# EAGLE design IR_and_skip (EAGLE 5.11)
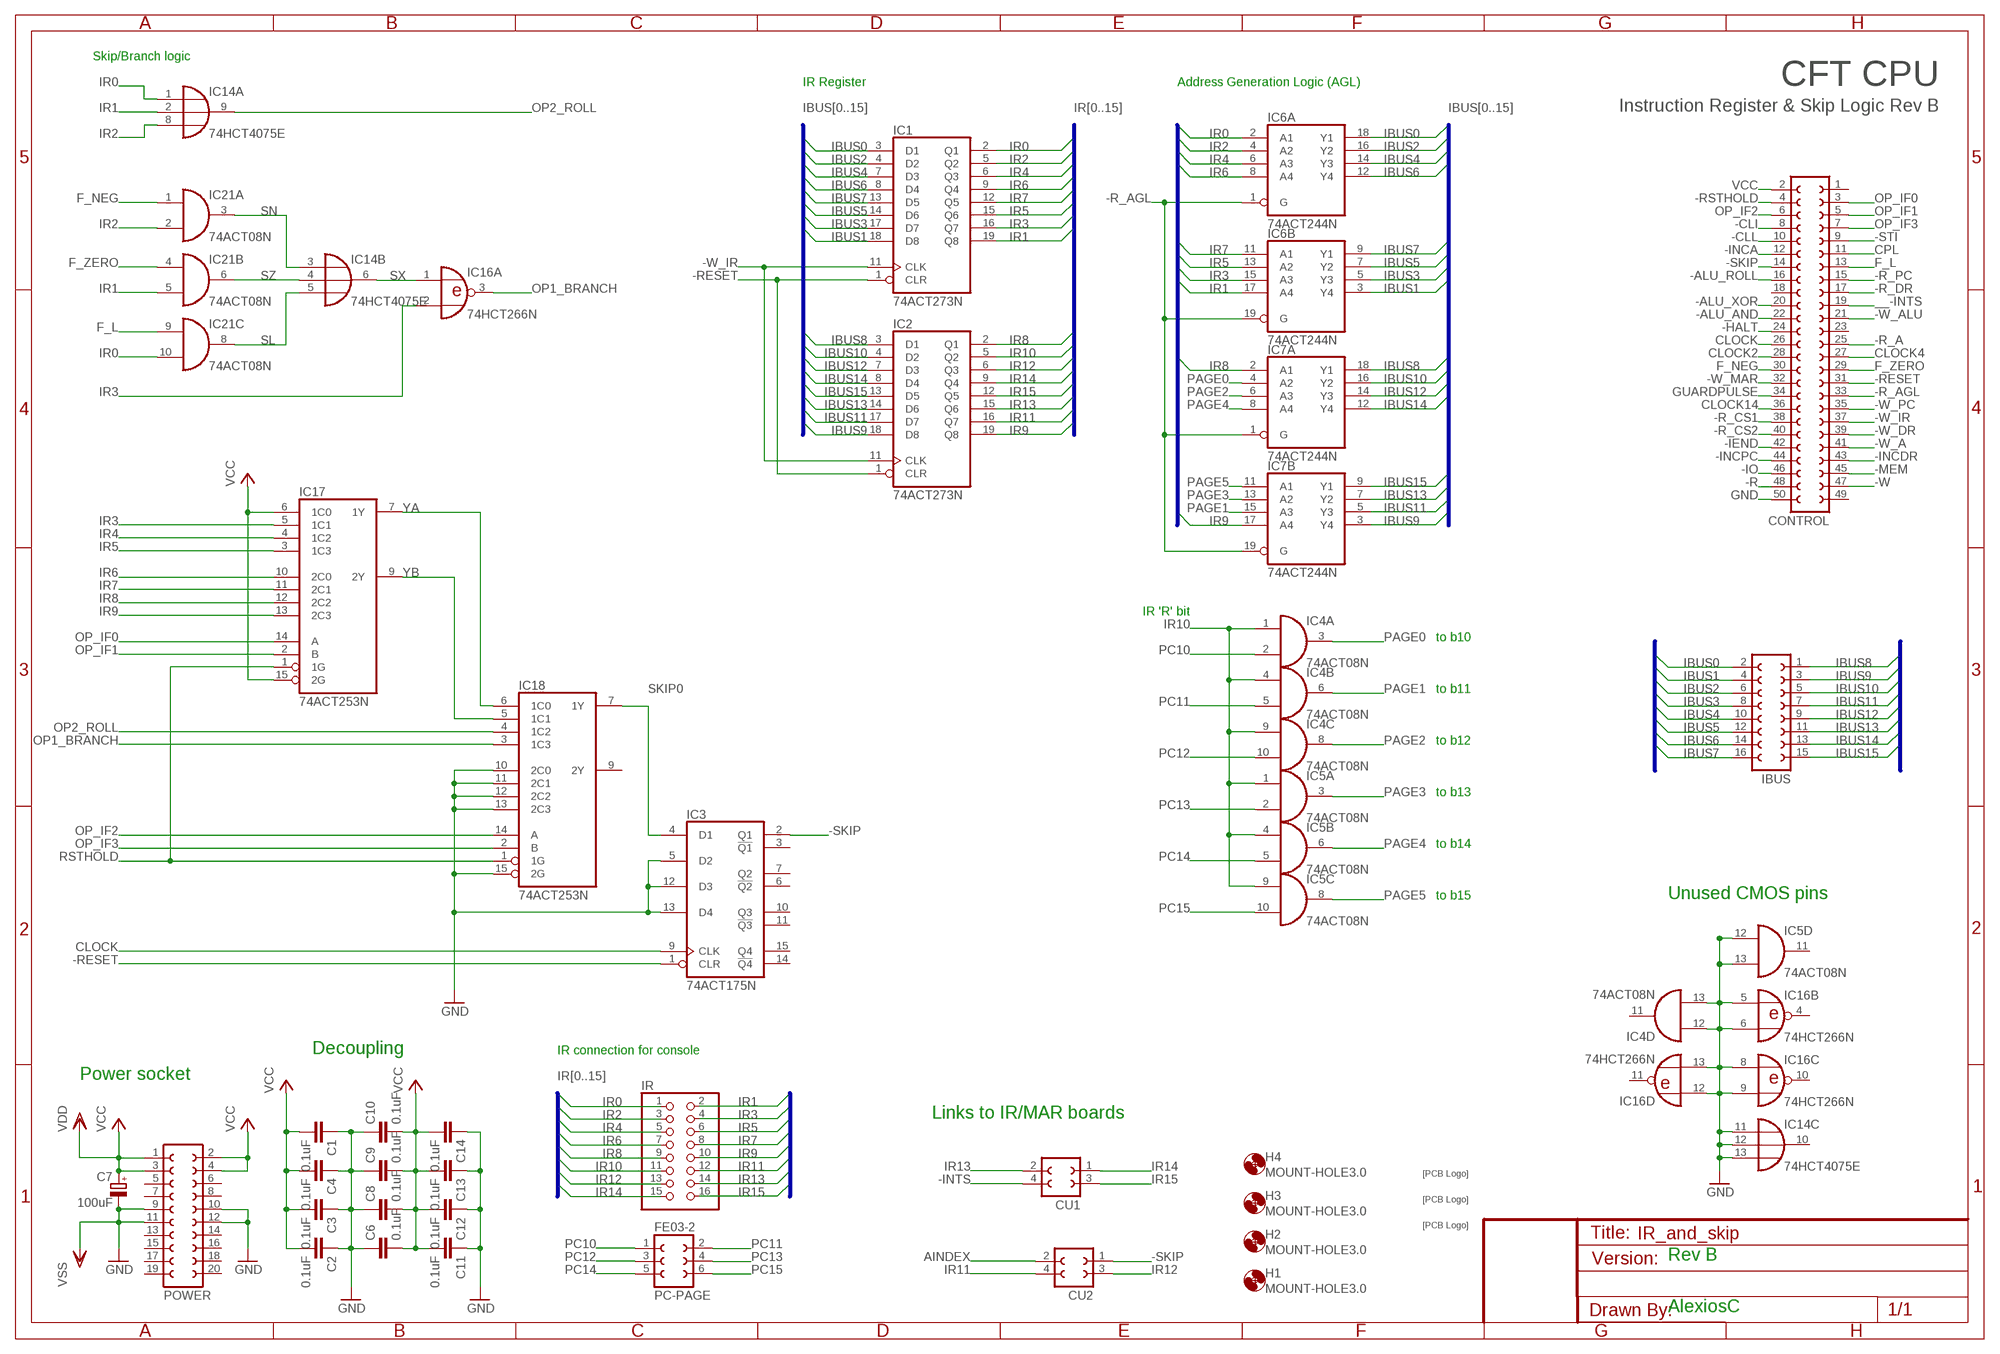
[diagram p0: schematic, sheet 1]

## Parts
C1  0.1uF  C-EU025-025X050  [C025-025X050]
C2  0.1uF  C-EU025-025X050  [C025-025X050]
C3  0.1uF  C-EU025-025X050  [C025-025X050]
C4  0.1uF  C-EU025-025X050  [C025-025X050]
C6  0.1uF  C-EU025-025X050  [C025-025X050]
C7  100uF  CPOL-EUE2.5-6  [E2,5-6]
C8  0.1uF  C-EU025-025X050  [C025-025X050]
C9  0.1uF  C-EU025-025X050  [C025-025X050]
C10  0.1uF  C-EU025-025X050  [C025-025X050]
C11  0.1uF  C-EU025-025X050  [C025-025X050]
C12  0.1uF  C-EU025-025X050  [C025-025X050]
C13  0.1uF  C-EU025-025X050  [C025-025X050]
C14  0.1uF  C-EU025-025X050  [C025-025X050]
CONTROL  FE25-2  [FE25-2]
CU1  FE02-2  [FE02-2]
CU2  FE02-2  [FE02-2]
H1  MOUNT-HOLE3.0  [3,0]
H2  MOUNT-HOLE3.0  [3,0]
H3  MOUNT-HOLE3.0  [3,0]
H4  MOUNT-HOLE3.0  [3,0]
IBUS  FE08-2  [FE08-2]
IC1  74ACT273N  [DIL20]
IC2  74ACT273N  [DIL20]
IC3  74ACT175N  [DIL16]
IC4  74ACT08N  [DIL14]
IC5  74ACT08N  [DIL14]
IC6  74ACT244N  [DIL20]
IC7  74ACT244N  [DIL20]
IC14  74HCT4075E  4075N  [DIL14]
IC16  74HCT266N  74HC266N  [DIL14]
IC17  74ACT253N  [DIL16]
IC18  74ACT253N  [DIL16]
IC21  74ACT08N  [DIL14]
IR  PINHD-2X8/90  [2X08/90]
PC-PAGE  FE03-2  [FE03-2]
POWER  FE10-2  [FE10-2]
U$1  SIGNATUREPLANE  [SIGNATURE_PLANE]
U$2  SIGNATUREPLANE  [SIGNATURE_PLANE]
U$3  SIGNATURESILK  [SIGNATURE]

## Nets
-ALU_AND: CONTROL.22
-ALU_ROLL: CONTROL.16
-ALU_XOR: CONTROL.20
-CLI: CONTROL.8
-CLL: CONTROL.10
-HALT: CONTROL.24
-IEND: CONTROL.42
-INCA: CONTROL.12
-INCDR: CONTROL.43
-INCPC: CONTROL.44
-INTS: CU1.4
-IO: CONTROL.46
-MEM: CONTROL.45
-R: CONTROL.48
-R_A: CONTROL.25
-R_AGL: CONTROL.33 IC6.1(A:G) IC6.19(B:G) IC7.1(A:G) IC7.19(B:G)
-R_CS1: CONTROL.38
-R_CS2: CONTROL.40
-R_DR: CONTROL.17
-R_PC: CONTROL.15
-RESET: CONTROL.31 IC1.1(CLR) IC2.1(CLR) IC3.1(CLR)
-RSTHOLD: CONTROL.4
-SKIP: CONTROL.14 CU2.1 IC3.2(Q1)
-STI: CONTROL.9
-W: CONTROL.47
-W_A: CONTROL.41
-W_ALU: CONTROL.21
-W_DR: CONTROL.39
-W_IR: CONTROL.37 IC1.11(CLK) IC2.11(CLK)
-W_MAR: CONTROL.32
-W_PC: CONTROL.35
AINDEX: CU2.2
CLOCK: CONTROL.26 IC3.9(CLK)
CLOCK2: CONTROL.28
CLOCK4: CONTROL.27
CLOCK14: CONTROL.36
CPL: CONTROL.11
F_L: CONTROL.13 IC21.9(C:I0)
F_NEG: CONTROL.30 IC21.1(A:I0)
F_ZERO: CONTROL.29 IC21.4(B:I0)
GND: C1.1 C2.1 C3.1 C4.1 C6.1 C7.- C8.1 C9.1 C10.1 C11.1 C12.1 C13.1 C14.1 CONTROL.50 IC3.5(D2) IC3.12(D3) IC3.13(D4) IC4.12(D:I0) IC4.13(D:I1) IC5.12(D:I0) IC5.13(D:I1) IC14.11(C:I0) IC14.12(C:I1) IC14.13(C:I2) IC16.5(B:I0) IC16.6(B:I1) IC16.8(C:I0) IC16.9(C:I1) IC16.12(D:I0) IC16.13(D:I1) IC18.10(2C0) IC18.11(2C1) IC18.12(2C2) IC18.13(2C3) IC18.15(2G) POWER.9 POWER.10 POWER.11 POWER.12 ; supply symbol labelled VSS
GUARDPULSE: CONTROL.34
IBUS0: IBUS.2 IC1.3(D1) IC6.18(A:Y1)
IBUS1: IBUS.4 IC1.18(D8) IC6.3(B:Y4)
IBUS2: IBUS.6 IC1.4(D2) IC6.16(A:Y2)
IBUS3: IBUS.8 IC1.17(D7) IC6.5(B:Y3)
IBUS4: IBUS.10 IC1.7(D3) IC6.14(A:Y3)
IBUS5: IBUS.12 IC1.14(D6) IC6.7(B:Y2)
IBUS6: IBUS.14 IC1.8(D4) IC6.12(A:Y4)
IBUS7: IBUS.16 IC1.13(D5) IC6.9(B:Y1)
IBUS8: IBUS.1 IC2.3(D1) IC7.18(A:Y1)
IBUS9: IBUS.3 IC2.18(D8) IC7.3(B:Y4)
IBUS10: IBUS.5 IC2.4(D2) IC7.16(A:Y2)
IBUS11: IBUS.7 IC2.17(D7) IC7.5(B:Y3)
IBUS12: IBUS.9 IC2.7(D3) IC7.14(A:Y3)
IBUS13: IBUS.11 IC2.14(D6) IC7.7(B:Y2)
IBUS14: IBUS.13 IC2.8(D4) IC7.12(A:Y4)
IBUS15: IBUS.15 IC2.13(D5) IC7.9(B:Y1)
IR0: IC1.2(Q1) IC6.2(A:A1) IC14.1(A:I0) IC21.10(C:I1) IR.1
IR1: IC1.19(Q8) IC6.17(B:A4) IC14.2(A:I1) IC21.5(B:I1) IR.2
IR2: IC1.5(Q2) IC6.4(A:A2) IC14.8(A:I2) IC21.2(A:I1) IR.3
IR3: IC1.16(Q7) IC6.15(B:A3) IC16.2(A:I1) IC17.5(1C1) IR.4
IR4: IC1.6(Q3) IC6.6(A:A3) IC17.4(1C2) IR.5
IR5: IC1.15(Q6) IC6.13(B:A2) IC17.3(1C3) IR.6
IR6: IC1.9(Q4) IC6.8(A:A4) IC17.10(2C0) IR.7
IR7: IC1.12(Q5) IC6.11(B:A1) IC17.11(2C1) IR.8
IR8: IC2.2(Q1) IC7.2(A:A1) IC17.12(2C2) IR.9
IR9: IC2.19(Q8) IC7.17(B:A4) IC17.13(2C3) IR.10
IR10: IC2.5(Q2) IC4.1(A:I0) IC4.4(B:I0) IC4.9(C:I0) IC5.1(A:I0) IC5.4(B:I0) IC5.9(C:I0) IR.11
IR11: CU2.4 IC2.16(Q7) IR.12
IR12: CU2.3 IC2.6(Q3) IR.13
IR13: CU1.2 IC2.15(Q6) IR.14
IR14: CU1.1 IC2.9(Q4) IR.15
IR15: CU1.3 IC2.12(Q5) IR.16
OP1_BRANCH: IC16.3(A:O) IC18.3(1C3)
OP2_ROLL: IC14.9(A:O) IC18.4(1C2)
OP_IF0: CONTROL.3 IC17.14(A)
OP_IF1: CONTROL.5 IC17.2(B)
OP_IF2: CONTROL.6 IC18.14(A)
OP_IF3: CONTROL.7 IC18.2(B)
PAGE0: IC4.3(A:O) IC7.4(A:A2)
PAGE1: IC4.6(B:O) IC7.15(B:A3)
PAGE2: IC4.8(C:O) IC7.6(A:A3)
PAGE3: IC5.3(A:O) IC7.13(B:A2)
PAGE4: IC5.6(B:O) IC7.8(A:A4)
PAGE5: IC5.8(C:O) IC7.11(B:A1)
PC10: IC4.2(A:I1) PC-PAGE.1
PC11: IC4.5(B:I1) PC-PAGE.2
PC12: IC4.10(C:I1) PC-PAGE.3
PC13: IC5.2(A:I1) PC-PAGE.4
PC14: IC5.5(B:I1) PC-PAGE.5
PC15: IC5.10(C:I1) PC-PAGE.6
RSTHOLD: IC17.1(1G) IC18.1(1G)
SKIP0: IC3.4(D1) IC18.7(1Y)
SL: IC14.5(B:I2) IC21.8(C:O)
SN: IC14.3(B:I0) IC21.3(A:O)
SX: IC14.6(B:O) IC16.1(A:I0)
SZ: IC14.4(B:I1) IC21.6(B:O)
VCC: C1.2 C2.2 C3.2 C4.2 C6.2 C7.+ C8.2 C9.2 C10.2 C11.2 C12.2 C13.2 C14.2 CONTROL.2 IC17.6(1C0) IC17.15(2G) POWER.1 POWER.2 POWER.3 POWER.4 ; supply symbol labelled VDD
YA: IC17.7(1Y) IC18.6(1C0)
YB: IC17.9(2Y) IC18.5(1C1)
Unconnected: CONTROL.1 CONTROL.18 CONTROL.19 CONTROL.23 CONTROL.49 IC3.3(!Q1) IC3.6(!Q2) IC3.7(Q2) IC3.10(Q3) IC3.11(!Q3) IC3.14(!Q4) IC3.15(Q4) IC4.11(D:O) IC5.11(D:O) IC14.10(C:O) IC16.4(B:O) IC16.10(C:O) IC16.11(D:O) IC18.9(2Y) IC21.11(D:O) IC21.12(D:I0) IC21.13(D:I1) POWER.5 POWER.6 POWER.7 POWER.8 POWER.13 POWER.14 POWER.15 POWER.16 POWER.17 POWER.18 POWER.19 POWER.20

## Buses
IBUS[0..15]
IR[0..15]

## Notes on the sheet
- Skip/Branch logic
- IR Register | Address Generation Logic (AGL) | CFT CPU
- Instruction Register & Skip Logic Rev B
- IR 'R' bit
- to b10
- to b11
- to b12
- to b13
- to b14
- to b15 | Unused CMOS pins
- Decoupling | IR connection for console
- Power socket
- Links to IR/MAR boards
- Rev B
- AlexiosC

## Power pins joined to a net without a drawn wire
GND: IC1.10(GND) IC2.10(GND) IC3.8(GND) IC4.7(P:GND) IC5.7(P:GND) IC6.10(P:GND) IC7.10(P:GND) IC14.7(P:VSS) IC16.7(P:GND) IC17.8(GND) IC18.8(GND) IC21.7(P:GND)
VCC: IC1.20(VCC) IC2.20(VCC) IC3.16(VCC) IC4.14(P:VCC) IC5.14(P:VCC) IC6.20(P:VCC) IC7.20(P:VCC) IC14.14(P:VDD) IC16.14(P:VCC) IC17.16(VCC) IC18.16(VCC) IC21.14(P:VCC)

## Library data of the parts
C1-C4 C6 C8-C14 = rcl:C-EU: CAPACITOR, European symbol
C7 = rcl:CPOL-EU: POLARIZED CAPACITOR, European symbol
CONTROL = con-lsta:FE25-2: FEMALE HEADER
CU1 CU2 = alexios:FE02-2: A 2x2 pin female header.
H1-H4 = holes:MOUNT-HOLE: MOUNTING HOLE with drill center marker
IBUS = con-lsta:FE08-2: FEMALE HEADER
IC1 IC2 = 74xx-eu:74*273: Octal D type FLIP FLOP, clear
IC3 = 74xx-eu:74*175: Qadruple D type FLIP FLOP, clear
IC4 IC5 IC21 = 74xx-eu:74*08: Quad 2-input AND gate
IC6 IC7 = 74xx-eu:74*244: Octal BUFFER and LINE DRIVER, 3-state
IC14 = 40xx:4075: Triple 3-input OR
IC16 = 74xx-eu:74*266: Quadruple EXCLUSIVE-NOR (XNOR), open-collector
IC17 IC18 = 74xx-eu:74*253: Dual 4-to 1 line data SELECTOR/MULTIPLEXER, 3-state
IR = pinhead:PINHD-2X8: PIN HEADER
PC-PAGE = alexios:FE03-2: A 2x3 female header.
POWER = con-lsta:FE10-2: FEMALE HEADER; OC_FARNELL: unknown; OC_NEWARK: unknown
U$1-U$3 = alexios:SIGNATURE: Soup signature

## Net classes
0 default: width 0.406 mm, clearance 0.305 mm
1 Decoupling: width 1.27 mm

## Board
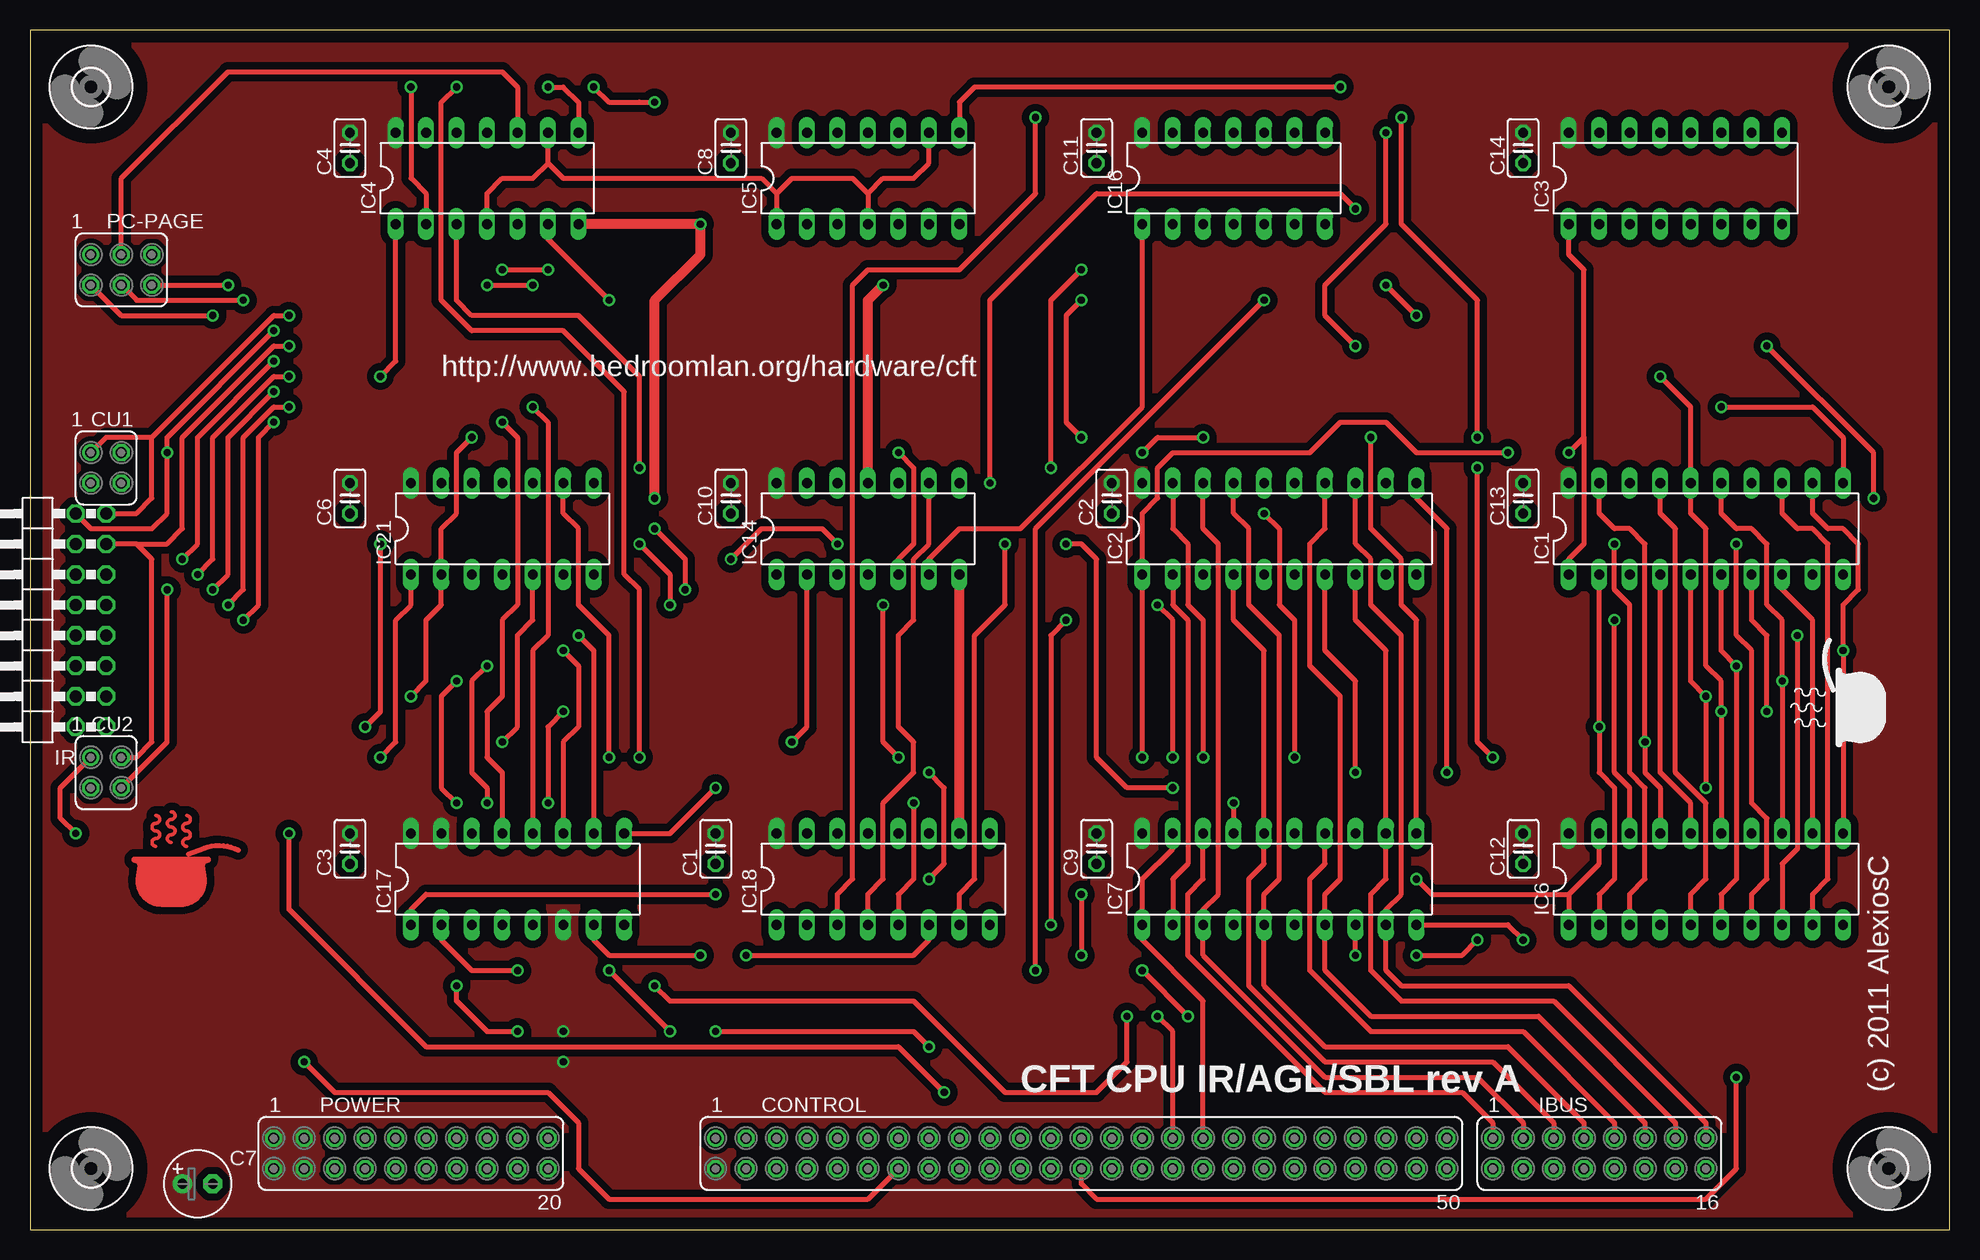
[diagram p1: board, top side]
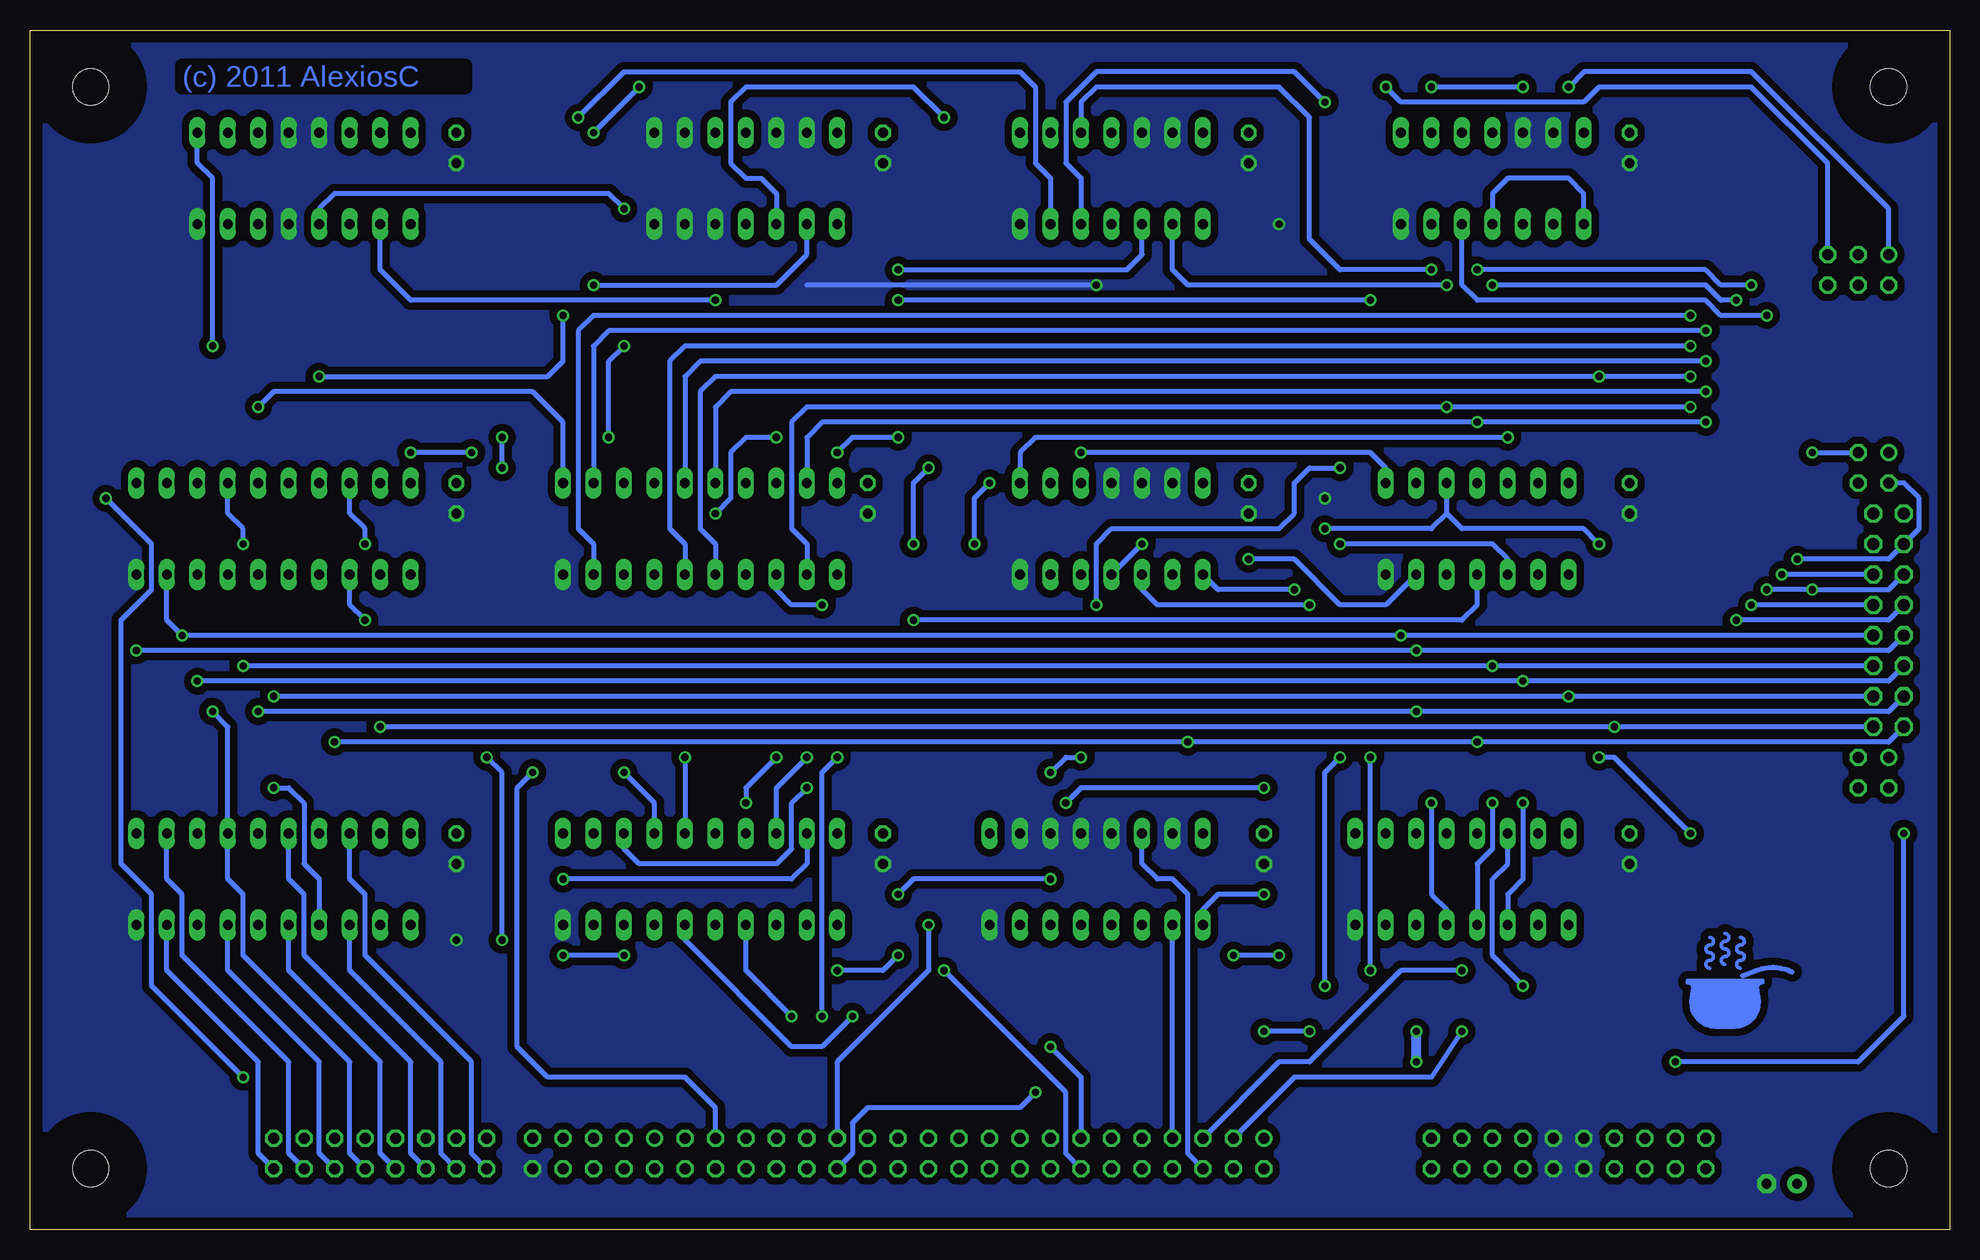
[diagram p2: board, bottom side, seen from below]

Size 160 x 100 mm. Coordinates in mm from the lower left corner, seen from the top.
Outline: 0,0 160,0 160,100 0,100 0,0
Copper layers (1*16): Top 0.035mm / dielectric 1.5mm / Bottom 0.035mm
Design rules "olimex-10mil": minimum track width 10mil, minimum drill 24mil, track to track 10mil, track to pad 10mil, pad to pad 10mil, via to via 10mil, smd to smd 10mil, copper to edge 40mil, drill to drill 10mil, minimum pad ring 10mil, minimum via ring 8mil, stop-mask expansion 0mil, vias tented up to drill 0mil, thermal gap 10mil

### Footprints (pad centres in the part's own frame; a part is rotated, then mirrored left to right if it is on the bottom)
C025-025X050 = drill 0.813 octagon: 1 -1.27,0; 2 1.27,0
E2,5-6 = drill 0.813 pad 1.6 round: + -1.27,0 | drill 0.813 pad 1.6 octagon: - 1.27,0
FE25-2 = drill 0.914 round: 1 -30.48,1.27; 41 20.32,1.27 | drill 0.914 octagon: 2 -30.48,-1.27; 3 -27.94,1.27; 4 -27.94,-1.27; 5 -25.4,1.27; 6 -25.4,-1.27; 7 -22.86,1.27; 8 -22.86,-1.27; 9 -20.32,1.27; 10 -20.32,-1.27; 11 -17.78,1.27; 12 -17.78,-1.27; 13 -15.24,1.27; 14 -15.24,-1.27; 15 -12.7,1.27; 16 -12.7,-1.27; 17 -10.16,1.27; 18 -10.16,-1.27; 19 -7.62,1.27; 20 -7.62,-1.27; 21 -5.08,1.27; 22 -5.08,-1.27; 23 -2.54,1.27; 24 -2.54,-1.27; 25 0,1.27; 26 0,-1.27; 27 2.54,1.27; 28 2.54,-1.27; 29 5.08,1.27; 30 5.08,-1.27; 31 7.62,1.27; 32 7.62,-1.27; 33 10.16,1.27; 34 10.16,-1.27; 35 12.7,1.27; 36 12.7,-1.27; 37 15.24,1.27; 38 15.24,-1.27; 39 17.78,1.27; 40 17.78,-1.27; 42 20.32,-1.27; 43 22.86,1.27; 44 22.86,-1.27; 45 25.4,1.27; 46 25.4,-1.27; 47 27.94,1.27; 48 27.94,-1.27; 49 30.48,1.27; 50 30.48,-1.27
FE02-2 = drill 0.914 round: 1 -1.27,1.27 | drill 0.914 octagon: 2 -1.27,-1.27; 3 1.27,1.27; 4 1.27,-1.27
3,0 = hole 3: 0,0
FE08-2 = drill 0.914 octagon: 1 -8.89,1.27; 2 -8.89,-1.27; 3 -6.35,1.27; 4 -6.35,-1.27; 5 -3.81,1.27; 6 -3.81,-1.27; 7 -1.27,1.27; 8 -1.27,-1.27; 9 1.27,1.27; 10 1.27,-1.27; 11 3.81,1.27; 12 3.81,-1.27; 13 6.35,1.27; 14 6.35,-1.27; 15 8.89,1.27; 16 8.89,-1.27
DIL20 = drill 0.813 long: 1 -11.43,-3.81; 2 -8.89,-3.81; 3 -6.35,-3.81; 4 -3.81,-3.81; 5 -1.27,-3.81; 6 1.27,-3.81; 7 3.81,-3.81; 8 6.35,-3.81; 9 8.89,-3.81; 10 11.43,-3.81; 11 11.43,3.81; 12 8.89,3.81; 13 6.35,3.81; 14 3.81,3.81; 15 1.27,3.81; 16 -1.27,3.81; 17 -3.81,3.81; 18 -6.35,3.81; 19 -8.89,3.81; 20 -11.43,3.81
DIL16 = drill 0.813 long: 1 -8.89,-3.81; 2 -6.35,-3.81; 3 -3.81,-3.81; 4 -1.27,-3.81; 5 1.27,-3.81; 6 3.81,-3.81; 7 6.35,-3.81; 8 8.89,-3.81; 9 8.89,3.81; 10 6.35,3.81; 11 3.81,3.81; 12 1.27,3.81; 13 -1.27,3.81; 14 -3.81,3.81; 15 -6.35,3.81; 16 -8.89,3.81
DIL14 = drill 0.813 long: 1 -7.62,-3.81; 2 -5.08,-3.81; 3 -2.54,-3.81; 4 0,-3.81; 5 2.54,-3.81; 6 5.08,-3.81; 7 7.62,-3.81; 8 7.62,3.81; 9 5.08,3.81; 10 2.54,3.81; 11 0,3.81; 12 -2.54,3.81; 13 -5.08,3.81; 14 -7.62,3.81
2X08/90 = drill 1.016 octagon: 1 -8.89,-6.35; 2 -8.89,-3.81; 3 -6.35,-6.35; 4 -6.35,-3.81; 5 -3.81,-6.35; 6 -3.81,-3.81; 7 -1.27,-6.35; 8 -1.27,-3.81; 9 1.27,-6.35; 10 1.27,-3.81; 11 3.81,-6.35; 12 3.81,-3.81; 13 6.35,-6.35; 14 6.35,-3.81; 15 8.89,-6.35; 16 8.89,-3.81
FE03-2 = drill 0.914 round: 1 -2.54,1.27 | drill 0.914 octagon: 2 -2.54,-1.27; 3 0,1.27; 4 0,-1.27; 5 2.54,1.27; 6 2.54,-1.27
FE10-2 = drill 0.914 octagon: 1 -11.43,1.27; 2 -11.43,-1.27; 3 -8.89,1.27; 4 -8.89,-1.27; 5 -6.35,1.27; 6 -6.35,-1.27; 7 -3.81,1.27; 8 -3.81,-1.27; 9 -1.27,1.27; 10 -1.27,-1.27; 11 1.27,1.27; 12 1.27,-1.27; 13 3.81,1.27; 14 3.81,-1.27; 15 6.35,1.27; 16 6.35,-1.27; 17 8.89,1.27; 18 8.89,-1.27; 19 11.43,1.27; 20 11.43,-1.27

### Placement (x,y rotation side)
C1  57.15,31.75 90 top
C2  90.17,60.96 90 top
C3  26.67,31.75 90 top
C4  26.67,90.17 90 top
C6  26.67,60.96 90 top
C7  13.97,3.81 0 top
C8  58.42,90.17 90 top
C9  88.9,31.75 90 top
C10  58.42,60.96 90 top
C11  88.9,90.17 90 top
C12  124.46,31.75 90 top
C13  124.46,60.96 90 top
C14  124.46,90.17 90 top
CONTROL  87.63,6.35 0 top
CU1  6.35,63.5 0 top
CU2  6.35,38.1 0 top
H1  154.94,95.25 0 top
H2  154.94,5.08 0 top
H3  5.08,5.08 0 top
H4  5.08,95.25 0 top
IBUS  130.81,6.35 0 top
IC1  139.7,58.42 0 top
IC2  104.14,58.42 0 top
IC3  137.16,87.63 0 top
IC4  38.1,87.63 0 top
IC5  69.85,87.63 0 top
IC6  139.7,29.21 0 top
IC7  104.14,29.21 0 top
IC14  69.85,58.42 0 top
IC16  100.33,87.63 0 top
IC17  40.64,29.21 0 top
IC18  71.12,29.21 0 top
IC21  39.37,58.42 0 top
IR  0,50.8 90 top
PC-PAGE  7.62,80.01 0 top
POWER  31.75,6.35 0 top
U$1  8.89,26.67 0 top
U$2  21.59,16.51 0 bottom
U$3  154.94,40.64 90 top

### Tracks (layer width: path | path; a pad name or v marks a point on that pad's centre or on a via)
-R_AGL  (via drill 0.6)
  Top 0.406: IC6.19 130.81,30.48 128.27,27.94 | 128.27,27.94 IC6.1 | IC7.19 95.25,31.75 92.71,29.21 IC7.1 92.71,24.13 97.79,19.05 CONTROL.33 | 128.27,27.94 116.84,27.94 v115.57,29.21
  Bottom 0.406: v115.57,29.21 96.52,29.21 95.25,30.48 IC7.19
-RESET  (via drill 0.6)
  Top 0.406: v92.71,39.37 IC2.1 92.71,59.69 93.98,60.96 93.98,63.5 95.25,64.77 106.68,64.77 109.22,67.31 113.03,67.31 115.57,64.77 v123.19,64.77 | IC1.1 128.27,55.88 129.54,57.15 129.54,66.04 | 129.54,66.04 129.54,80.01 128.27,81.28 IC3.1 | v128.27,64.77 129.54,66.04 | CONTROL.31 95.25,16.51 v93.98,17.78
  Bottom 0.406: v93.98,17.78 93.98,38.1 v92.71,39.37 | v123.19,64.77 v128.27,64.77
-SKIP  (via drill 0.6)
  Top 0.406: v102.87,77.47 83.82,58.42 v83.82,21.59 | CONTROL.14 69.85,2.54 48.26,2.54 45.72,5.08 45.72,8.89 43.18,11.43 25.4,11.43 v22.86,13.97 | CU2.1 2.54,36.83 2.54,34.29 v3.81,33.02
  Bottom 0.406: CONTROL.14 73.66,6.35 73.66,11.43 v83.82,21.59 | v102.87,77.47 128.27,77.47 130.81,80.01 IC3.2 | v22.86,13.97 7.62,13.97 3.81,17.78 v3.81,33.02
-W_IR  (via drill 0.6)
  Top 0.406: v118.11,38.1 118.11,58.42 115.57,60.96 IC2.11 | v140.97,68.58 148.59,68.58 151.13,66.04 IC1.11
  Bottom 0.406: v140.97,68.58 139.7,69.85 118.11,69.85 115.57,67.31 IC2.11 | CONTROL.37 102.87,10.16 105.41,12.7 116.84,12.7 119.38,15.24 119.38,36.83 v118.11,38.1
CLOCK  (via drill 0.6)
  Top 0.406: CONTROL.26 87.63,3.81 88.9,2.54 139.7,2.54 142.24,5.08 v142.24,12.7 | v153.67,60.96 153.67,64.77 v144.78,73.66
  Bottom 0.406: v142.24,12.7 149.86,20.32 149.86,27.94 152.4,30.48 152.4,50.8 149.86,53.34 149.86,57.15 v153.67,60.96 | v144.78,73.66 144.78,87.63 146.05,88.9 IC3.9
F_L  (via drill 0.6)
  Top 0.406: v57.15,16.51 73.66,16.51 v74.93,15.24 | v48.26,39.37 48.26,49.53 45.72,52.07 45.72,58.42 44.45,59.69 IC21.9 | v53.34,16.51 v48.26,21.59
  Bottom 0.406: v53.34,16.51 v57.15,16.51 | v48.26,21.59 v48.26,39.37 | v74.93,15.24 72.39,12.7 CONTROL.13
F_NEG  (via drill 0.6)
  Top 0.406: v76.2,11.43 72.39,15.24 33.02,15.24 21.59,26.67 v21.59,33.02 | v29.21,39.37 30.48,40.64 30.48,50.8 31.75,52.07 IC21.1
  Bottom 0.406: CONTROL.30 91.44,6.35 91.44,8.89 90.17,10.16 77.47,10.16 v76.2,11.43 | v21.59,33.02 27.94,39.37 v29.21,39.37
F_ZERO  (via drill 0.6)
  Top 0.406: v85.09,25.4 85.09,49.53 v86.36,50.8
  Bottom 0.406: CONTROL.29 92.71,13.97 85.09,21.59 v85.09,25.4 | v86.36,50.8 40.64,50.8 39.37,52.07 IC21.4
GND  (via drill 0.6)
  Top 0.406: IC7.10 123.19,25.4 v124.46,24.13
  Top 0.813: IC18.10 IC14.7 | IC4.7 v55.88,83.82 55.88,81.28 52.07,77.47 v52.07,60.96 | v71.12,78.74 69.85,77.47 IC14.11
  Bottom 0.406: v71.12,78.74 95.25,78.74
  pour Bottom (isolate 0.508, no thermals): 30.48,8.89 29.21,7.62 29.21,5.08 30.48,3.81 33.02,3.81 34.29,5.08 34.29,7.62 33.02,8.89
  pour Bottom (isolate 0.61, no thermals): 0,100.33 0,0 160.02,0 160.02,100.33
IBUS0  (via drill 0.6)
  Top 0.406: IC6.18 133.35,36.83 132.08,38.1 v132.08,50.8
  Bottom 0.406: IBUS.2 123.19,6.35 123.19,13.97 132.08,22.86 132.08,27.94 133.35,29.21 IC6.18 | v132.08,50.8 133.35,52.07 IC1.3
IBUS1  (via drill 0.6)
  Top 0.406: IC6.3 133.35,27.94 134.62,29.21 134.62,36.83 133.35,38.1 133.35,52.07 132.08,53.34 v132.08,57.15
  Bottom 0.406: IBUS.4 125.73,6.35 125.73,13.97 133.35,21.59 IC6.3 | v132.08,57.15 132.08,58.42 133.35,59.69 IC1.18
IBUS2
  Top 0.406: IC6.16 138.43,35.56 135.89,38.1 IC1.4
  Bottom 0.406: IBUS.6 128.27,6.35 128.27,13.97 137.16,22.86 137.16,27.94 138.43,29.21 IC6.16
IBUS3
  Top 0.406: IC6.5 138.43,27.94 139.7,29.21 139.7,35.56 137.16,38.1 137.16,58.42 135.89,59.69 IC1.17
  Bottom 0.406: IBUS.8 130.81,6.35 130.81,13.97 138.43,21.59 IC6.5
IBUS4  (via drill 0.6)
  Top 0.406: v144.78,43.18 144.78,49.53 143.51,50.8 IC1.7
  Bottom 0.406: IBUS.10 133.35,6.35 133.35,13.97 142.24,22.86 142.24,27.94 143.51,29.21 IC6.14 143.51,41.91 v144.78,43.18
IBUS5  (via drill 0.6)
  Top 0.406: IC6.7 143.51,27.94 144.78,29.21 144.78,34.29 143.51,35.56 143.51,48.26 142.24,49.53 v142.24,57.15
  Bottom 0.406: IBUS.12 135.89,6.35 135.89,13.97 143.51,21.59 IC6.7 | v142.24,57.15 142.24,58.42 143.51,59.69 IC1.14
IBUS6
  Top 0.406: IC6.12 148.59,50.8 146.05,53.34 IC1.8
  Bottom 0.406: IBUS.14 138.43,6.35 138.43,13.97 147.32,22.86 147.32,27.94 148.59,29.21 IC6.12
IBUS7
  Top 0.406: IC6.9 148.59,27.94 149.86,29.21 149.86,57.15 148.59,58.42 147.32,58.42 146.05,59.69 IC1.13
  Bottom 0.406: IBUS.16 140.97,6.35 140.97,13.97 148.59,21.59 IC6.9
IBUS8  (via drill 0.6)
  Top 0.406: IBUS.1 121.92,8.89 119.38,11.43 107.95,11.43 96.52,22.86 96.52,27.94 97.79,29.21 IC7.18 | v95.25,39.37 95.25,50.8 v93.98,52.07
  Bottom 0.406: IC7.18 97.79,36.83 v95.25,39.37 | v93.98,52.07 96.52,52.07 97.79,53.34 IC2.3
IBUS9
  Top 0.406: IBUS.3 124.46,8.89 120.65,12.7 107.95,12.7 97.79,22.86 IC7.3 97.79,26.67 99.06,27.94 99.06,57.15 97.79,58.42 IC2.18
IBUS10
  Top 0.406: IBUS.5 127,8.89 121.92,13.97 107.95,13.97 101.6,20.32 101.6,29.21 102.87,30.48 IC7.16 102.87,48.26 100.33,50.8 IC2.4
IBUS11
  Top 0.406: IBUS.7 129.54,8.89 123.19,15.24 107.95,15.24 102.87,20.32 IC7.5 102.87,27.94 104.14,29.21 104.14,49.53 101.6,52.07 101.6,58.42 100.33,59.69 IC2.17
IBUS12  (via drill 0.6)
  Top 0.406: IBUS.9 132.08,8.89 124.46,16.51 111.76,16.51 106.68,21.59 106.68,29.21 107.95,30.48 IC7.14 | v110.49,38.1 110.49,45.72 107.95,48.26 IC2.7
  Bottom 0.406: IC7.14 107.95,35.56 v110.49,38.1
IBUS13
  Top 0.406: IBUS.11 134.62,8.89 125.73,17.78 111.76,17.78 107.95,21.59 IC7.7 107.95,27.94 109.22,29.21 109.22,44.45 106.68,46.99 106.68,57.15 107.95,58.42 IC2.14
IBUS14
  Top 0.406: IBUS.13 137.16,8.89 127,19.05 114.3,19.05 111.76,21.59 111.76,27.94 113.03,29.21 IC7.12 113.03,48.26 110.49,50.8 IC2.8
IBUS15
  Top 0.406: IBUS.15 139.7,8.89 128.27,20.32 114.3,20.32 113.03,21.59 IC7.9 113.03,26.67 114.3,27.94 114.3,49.53 111.76,52.07 111.76,55.88 110.49,57.15 IC2.13
IR0  (via drill 0.6)
  Top 0.406: IC6.2 130.81,27.94 132.08,29.21 132.08,36.83 130.81,38.1 v130.81,41.91 IC1.2 | v29.21,57.15 29.21,43.18 v27.94,41.91 | v52.07,58.42 54.61,55.88 v54.61,53.34
  Bottom 0.406: IR.1 v27.94,41.91 v130.81,41.91 | v54.61,53.34 60.96,53.34 IC14.1 | v52.07,58.42 43.18,58.42 41.91,59.69 | 41.91,59.69 IC21.10 | 41.91,59.69 40.64,58.42 30.48,58.42 v29.21,57.15
IR1  (via drill 0.6)
  Top 0.406: IC6.17 135.89,36.83 134.62,38.1 v134.62,40.64 134.62,57.15 133.35,58.42 132.08,58.42 130.81,59.69 IC1.19 | IC21.5 41.91,50.8 40.64,49.53 40.64,41.91 v39.37,40.64 | IC14.2 64.77,41.91 v63.5,40.64
  Bottom 0.406: IR.2 5.08,40.64 v39.37,40.64 v63.5,40.64 v134.62,40.64
IR2  (via drill 0.6)
  Top 0.406: v139.7,36.83 v139.7,44.45 138.43,45.72 IC1.5 | v31.75,44.45 33.02,45.72 33.02,50.8 34.29,52.07 IC21.2 34.29,58.42 35.56,59.69 35.56,64.77 v36.83,66.04
  Bottom 0.406: IC6.4 135.89,29.21 137.16,30.48 137.16,35.56 138.43,36.83 v139.7,36.83 | IR.3 v31.75,44.45 v139.7,44.45 | v36.83,66.04 76.2,66.04 77.47,64.77 IC14.8
IR3  (via drill 0.6)
  Top 0.406: IC6.15 v140.97,43.18 140.97,45.72 139.7,46.99 139.7,58.42 138.43,59.69 IC1.16 138.43,68.58 v135.89,71.12 | v115.57,76.2 v113.03,78.74 | v44.45,43.18 43.18,41.91 v43.18,35.56
  Bottom 0.406: IR.4 5.08,43.18 v44.45,43.18 v140.97,43.18 | v135.89,71.12 116.84,71.12 115.57,72.39 v115.57,76.2 | v113.03,78.74 97.79,78.74 95.25,81.28 IC16.2 | IC17.5 41.91,26.67 43.18,27.94 v43.18,35.56
IR4  (via drill 0.6)
  Top 0.406: IC6.6 140.97,27.94 142.24,29.21 v142.24,46.99 140.97,48.26 IC1.6 | v38.1,35.56 38.1,36.83 36.83,38.1 36.83,45.72 v38.1,46.99
  Bottom 0.406: IR.5 v38.1,46.99 v142.24,46.99 | IC17.4 39.37,30.48 38.1,31.75 v38.1,35.56
IR5  (via drill 0.6)
  Top 0.406: IC6.13 v146.05,45.72 146.05,50.8 144.78,52.07 144.78,57.15 143.51,58.42 142.24,58.42 140.97,59.69 IC1.15 | v35.56,45.72 34.29,44.45 34.29,36.83 v35.56,35.56
  Bottom 0.406: IR.6 5.08,45.72 v35.56,45.72 v146.05,45.72 | IC17.3 36.83,27.94 35.56,29.21 v35.56,35.56
IR6  (via drill 0.6)
  Top 0.406: IC17.10 46.99,48.26 v45.72,49.53 | IC6.8 146.05,30.48 147.32,31.75 v147.32,49.53
  Bottom 0.406: IR.7 v45.72,49.53 v147.32,49.53 148.59,50.8 IC1.9
IR7  (via drill 0.6)
  Top 0.406: IC17.11 44.45,40.64 45.72,41.91 45.72,46.99 v44.45,48.26 | IC6.11 v151.13,48.26 151.13,52.07 152.4,53.34 152.4,57.15 151.13,58.42 149.86,58.42 148.59,59.69 IC1.12
  Bottom 0.406: IR.8 5.08,48.26 v44.45,48.26 v151.13,48.26
IR8  (via drill 0.6)
  Top 0.406: v16.51,52.07 17.78,53.34 17.78,66.04 20.32,68.58 v21.59,68.58 | IC17.12 41.91,48.26 43.18,49.53 43.18,67.31 v41.91,68.58 | IC7.2 95.25,29.21 96.52,30.48 96.52,50.8 95.25,52.07 IC2.2
  Bottom 0.406: IR.9 v16.51,52.07 | v21.59,68.58 v41.91,68.58 95.25,68.58 96.52,67.31 96.52,58.42 95.25,57.15 IC2.2
IR9  (via drill 0.6)
  Top 0.406: v17.78,50.8 19.05,52.07 19.05,66.04 v20.32,67.31 | IC17.13 39.37,38.1 38.1,39.37 38.1,43.18 39.37,44.45 39.37,50.8 40.64,52.07 40.64,66.04 v39.37,67.31 | v100.33,35.56 IC7.17 | v97.79,39.37 97.79,50.8 96.52,52.07 96.52,57.15 95.25,58.42 IC2.19
  Bottom 0.406: IR.10 5.08,50.8 v17.78,50.8 | v20.32,67.31 v39.37,67.31 93.98,67.31 95.25,66.04 IC2.19 | v100.33,35.56 100.33,36.83 v97.79,39.37
IR10  (via drill 0.6)
  Top 0.406: v13.97,54.61 15.24,55.88 15.24,66.04 20.32,71.12 v21.59,71.12 | IC4.1 30.48,72.39 v29.21,71.12 | IC5.9 74.93,88.9 73.66,87.63 71.12,87.63 69.85,86.36 | 69.85,86.36 IC5.4 | 43.18,88.9 IC4.9 | 43.18,88.9 41.91,87.63 39.37,87.63 38.1,86.36 IC4.4 | 43.18,88.9 44.45,87.63 60.96,87.63 62.23,86.36 | 62.23,86.36 IC5.1 | 62.23,86.36 63.5,87.63 68.58,87.63 69.85,86.36
  Bottom 0.406: IR.11 v13.97,54.61 | v21.59,71.12 v29.21,71.12 102.87,71.12 104.14,69.85 104.14,58.42 102.87,57.15 IC2.5 | IC4.1 30.48,86.36 31.75,87.63 36.83,87.63 38.1,86.36 IC4.4
IR11  (via drill 0.6)
  Top 0.406: v15.24,53.34 16.51,54.61 16.51,66.04 v20.32,69.85 | CU2.4 11.43,40.64 v11.43,53.34
  Bottom 0.406: IR.12 5.08,53.34 v11.43,53.34 v15.24,53.34 | v20.32,69.85 101.6,69.85 102.87,68.58 IC2.16
IR12  (via drill 0.6)
  Top 0.406: 8.89,57.15 IR.13 | 8.89,57.15 11.43,57.15 12.7,58.42 12.7,66.04 20.32,73.66 v21.59,73.66 | CU2.3 8.89,39.37 10.16,40.64 10.16,55.88 8.89,57.15
  Bottom 0.406: v21.59,73.66 105.41,73.66 106.68,72.39 106.68,58.42 105.41,57.15 IC2.6
IR13  (via drill 0.6)
  Top 0.406: v12.7,55.88 13.97,57.15 13.97,66.04 v20.32,72.39
  Bottom 0.406: v12.7,55.88 5.08,55.88 IR.14 2.54,58.42 2.54,60.96 3.81,62.23 CU1.2 | v20.32,72.39 104.14,72.39 105.41,71.12 IC2.15
IR14  (via drill 0.6)
  Top 0.406: IR.15 8.89,59.69 10.16,60.96 10.16,66.04 | 10.16,66.04 20.32,76.2 v21.59,76.2 | CU1.1 6.35,66.04 10.16,66.04
  Bottom 0.406: v21.59,76.2 113.03,76.2 114.3,74.93 114.3,58.42 113.03,57.15 IC2.9
IR15  (via drill 0.6)
  Top 0.406: IR.16 5.08,58.42 10.16,58.42 11.43,59.69 v11.43,64.77 11.43,66.04 v20.32,74.93
  Bottom 0.406: v20.32,74.93 111.76,74.93 113.03,73.66 IC2.12 | v11.43,64.77 CU1.3
OP1_BRANCH  (via drill 0.6)
  Top 0.406: IC18.3 67.31,27.94 68.58,29.21 68.58,78.74 69.85,80.01 77.47,80.01 83.82,86.36 v83.82,92.71
  Bottom 0.406: v83.82,92.71 86.36,95.25 100.33,95.25 101.6,93.98 101.6,88.9 100.33,87.63 99.06,87.63 97.79,86.36 IC16.3
OP2_ROLL
  Top 0.406: IC18.4 69.85,27.94 71.12,29.21 71.12,35.56 73.66,38.1 73.66,40.64 72.39,41.91 72.39,49.53 73.66,50.8 73.66,55.88 74.93,57.15 IC14.9
OP_IF0  (via drill 0.6)
  Top 0.406: v35.56,20.32 35.56,19.05 38.1,16.51 v40.64,16.51
  Bottom 0.406: CONTROL.3 54.61,12.7 43.18,12.7 v40.64,16.51 | IC17.14 36.83,30.48 38.1,29.21 38.1,22.86 v35.56,20.32
OP_IF1  (via drill 0.6)
  Top 0.406: v40.64,21.59 36.83,21.59 34.29,24.13 IC17.2
  Bottom 0.406: CONTROL.5 55.88,13.97 53.34,13.97 45.72,21.59 v40.64,21.59
OP_IF2
  Bottom 0.406: CONTROL.6 63.5,6.35 63.5,27.94 64.77,29.21 66.04,29.21 67.31,30.48 IC18.14
OP_IF3
  Bottom 0.406: CONTROL.7 IC18.2
PAGE0  (via drill 0.6)
  Top 0.406: v72.39,39.37 71.12,40.64 v71.12,52.07 | v50.8,63.5 50.8,71.12 45.72,76.2 36.83,76.2 35.56,77.47 IC4.3 | v74.93,29.21 76.2,30.48 76.2,36.83 v74.93,38.1 | v87.63,27.94 v87.63,22.86 | v92.71,21.59 v96.52,17.78
  Bottom 0.406: v87.63,27.94 86.36,29.21 v74.93,29.21 | v72.39,39.37 73.66,39.37 v74.93,38.1 | v50.8,63.5 53.34,63.5 54.61,62.23 54.61,59.69 55.88,58.42 69.85,58.42 71.12,57.15 v71.12,52.07 | v96.52,17.78 100.33,21.59 IC7.4 | v87.63,22.86 88.9,21.59 v92.71,21.59
PAGE1  (via drill 0.6)
  Top 0.406: IC4.6 43.18,82.55 v48.26,77.47 | v105.41,39.37 105.41,50.8 104.14,52.07 104.14,58.42 v102.87,59.69 | v97.79,66.04 93.98,66.04 v92.71,64.77 | v87.63,77.47 86.36,76.2 86.36,67.31 v87.63,66.04
  Bottom 0.406: v48.26,77.47 v87.63,77.47 | v105.41,39.37 IC7.15 | v102.87,59.69 101.6,60.96 101.6,64.77 100.33,66.04 v97.79,66.04 | v92.71,64.77 91.44,66.04 v87.63,66.04
PAGE2  (via drill 0.6)
  Top 0.406: v91.44,17.78 91.44,13.97 88.9,11.43 81.28,11.43 73.66,19.05 53.34,19.05 v52.07,20.32 | v50.8,39.37 50.8,53.34 49.53,54.61 49.53,69.85 44.45,74.93 36.83,74.93 34.29,77.47 34.29,93.98 v35.56,95.25 | v43.18,95.25 44.45,95.25 45.72,93.98 IC4.8
  Bottom 0.406: IC7.6 105.41,24.13 96.52,15.24 93.98,15.24 v91.44,17.78 | v52.07,20.32 52.07,38.1 v50.8,39.37 | v35.56,95.25 v43.18,95.25
PAGE3  (via drill 0.6)
  Top 0.406: v85.09,63.5 85.09,77.47 v87.63,80.01 | v86.36,57.15 87.63,57.15 88.9,55.88 88.9,39.37 91.44,36.83 v95.25,36.83
  Bottom 0.406: IC5.3 67.31,81.28 68.58,80.01 v87.63,80.01 | v86.36,57.15 86.36,62.23 v85.09,63.5 | v95.25,36.83 96.52,35.56 96.52,31.75 97.79,30.48 109.22,30.48 110.49,31.75 IC7.13
PAGE4  (via drill 0.6)
  Top 0.406: v110.49,22.86 IC7.8 | v115.57,22.86 119.38,22.86 v120.65,24.13 | v121.92,39.37 120.65,40.64 v120.65,63.5 | v120.65,66.04 120.65,77.47 114.3,83.82 v114.3,92.71
  Bottom 0.406: v110.49,22.86 v115.57,22.86 | v120.65,24.13 120.65,38.1 v121.92,39.37 | v120.65,63.5 v120.65,66.04 | IC5.6 74.93,87.63 76.2,88.9 76.2,95.25 77.47,96.52 110.49,96.52 v114.3,92.71
PAGE5  (via drill 0.6)
  Top 0.406: IC7.11 115.57,50.8 114.3,52.07 114.3,55.88 111.76,58.42 v111.76,66.04 | v110.49,73.66 107.95,76.2 107.95,78.74 113.03,83.82 v113.03,91.44 | v109.22,95.25 78.74,95.25 77.47,93.98 IC5.8
  Bottom 0.406: v111.76,66.04 111.76,72.39 v110.49,73.66 | v113.03,91.44 v109.22,95.25
PC10  (via drill 0.6)
  Top 0.406: v31.75,95.25 31.75,87.63 33.02,86.36 IC4.2
  Bottom 0.406: PC-PAGE.1 5.08,85.09 16.51,96.52 30.48,96.52 v31.75,95.25
PC11  (via drill 0.6)
  Top 0.406: PC-PAGE.2 7.62,76.2 v15.24,76.2
  Bottom 0.406: IC4.5 40.64,78.74 39.37,77.47 20.32,77.47 19.05,76.2 v15.24,76.2
PC12
  Top 0.406: PC-PAGE.3 7.62,87.63 16.51,96.52 39.37,96.52 40.64,95.25 IC4.10
PC13  (via drill 0.6)
  Top 0.406: v38.1,78.74 v41.91,78.74 | PC-PAGE.4 8.89,77.47 v17.78,77.47
  Bottom 0.406: v38.1,78.74 20.32,78.74 19.05,77.47 v17.78,77.47 | v41.91,78.74 63.5,78.74 64.77,80.01 IC5.2
PC14  (via drill 0.6)
  Top 0.406: v46.99,95.25 48.26,93.98 50.8,93.98 v52.07,93.98
  Bottom 0.406: PC-PAGE.5 10.16,88.9 16.51,95.25 29.21,95.25 30.48,93.98 45.72,93.98 v46.99,95.25 | v52.07,93.98 54.61,96.52 71.12,96.52 73.66,93.98 73.66,88.9 72.39,87.63 IC5.5
PC15  (via drill 0.6)
  Top 0.406: v39.37,80.01 v43.18,80.01 | PC-PAGE.6 v16.51,78.74
  Bottom 0.406: v16.51,78.74 19.05,78.74 20.32,80.01 v39.37,80.01 | v43.18,80.01 50.8,80.01 53.34,82.55 53.34,92.71 55.88,95.25 71.12,95.25 72.39,93.98 IC5.10
RSTHOLD  (via drill 0.6)
  Top 0.406: IC17.1 31.75,26.67 33.02,27.94 v57.15,27.94
  Bottom 0.406: v57.15,27.94 60.96,27.94 62.23,26.67 IC18.1
SKIP0  (via drill 0.6)
  Top 0.406: IC18.7 77.47,27.94 78.74,29.21 78.74,49.53 81.28,52.07 v81.28,57.15 | v80.01,62.23 80.01,77.47 88.9,86.36 109.22,86.36 v110.49,85.09
  Bottom 0.406: v81.28,57.15 81.28,60.96 v80.01,62.23 | IC3.4 135.89,85.09 134.62,86.36 111.76,86.36 v110.49,85.09
SL  (via drill 0.6)
  Top 0.406: IC14.5 72.39,55.88 73.66,57.15 73.66,63.5 v72.39,64.77
  Bottom 0.406: IC21.8 46.99,63.5 48.26,64.77 v72.39,64.77
SN  (via drill 0.6)
  Top 0.406: v50.8,57.15 52.07,55.88 53.34,54.61 v53.34,52.07
  Bottom 0.406: IC21.3 36.83,55.88 38.1,57.15 v50.8,57.15 | v53.34,52.07 66.04,52.07 67.31,53.34 IC14.3
SX
  Top 0.406: IC14.6 74.93,55.88 77.47,58.42 82.55,58.42 92.71,68.58 IC16.1
SZ  (via drill 0.6)
  Top 0.406: v67.31,57.15 66.04,58.42 60.96,58.42 v58.42,55.88
  Bottom 0.406: v67.31,57.15 IC14.4 | v58.42,55.88 54.61,55.88 50.8,52.07 46.99,52.07 IC21.6
VCC  (via drill 0.6)
  Bottom 0.813: v44.45,13.97 v44.45,16.51
  pour Top (isolate 0.508, no thermals): 20.32,8.89 19.05,7.62 19.05,5.08 20.32,3.81 22.86,3.81 24.13,5.08 24.13,7.62 22.86,8.89
  pour Top (isolate 0.61, rank 6, no thermals): 0,100.33 0,0 160.02,0 160.02,100.33
YA  (via drill 0.6)
  Top 0.406: IC17.7 46.99,24.13 48.26,22.86 v55.88,22.86 | IC18.6 74.93,24.13 73.66,22.86 v59.69,22.86
  Bottom 0.406: v55.88,22.86 v59.69,22.86
YB  (via drill 0.6)
  Top 0.406: IC17.9 53.34,33.02 v57.15,36.83 | IC18.5 72.39,27.94 73.66,29.21 v73.66,35.56
  Bottom 0.406: v57.15,36.83 72.39,36.83 v73.66,35.56

### Text on the board
Bottom: (c) 2011 AlexiosC
tNames: http://www.bedroomlan.org/hardware/cft | CFT CPU IR/AGL/SBL rev A | (c) 2011 AlexiosC
tValues: +12V | +5V | GND